# Altium schematic sheet RK3399_PMIU.SchDoc
size A4; SheetNumber: 11; SheetTotal: 20
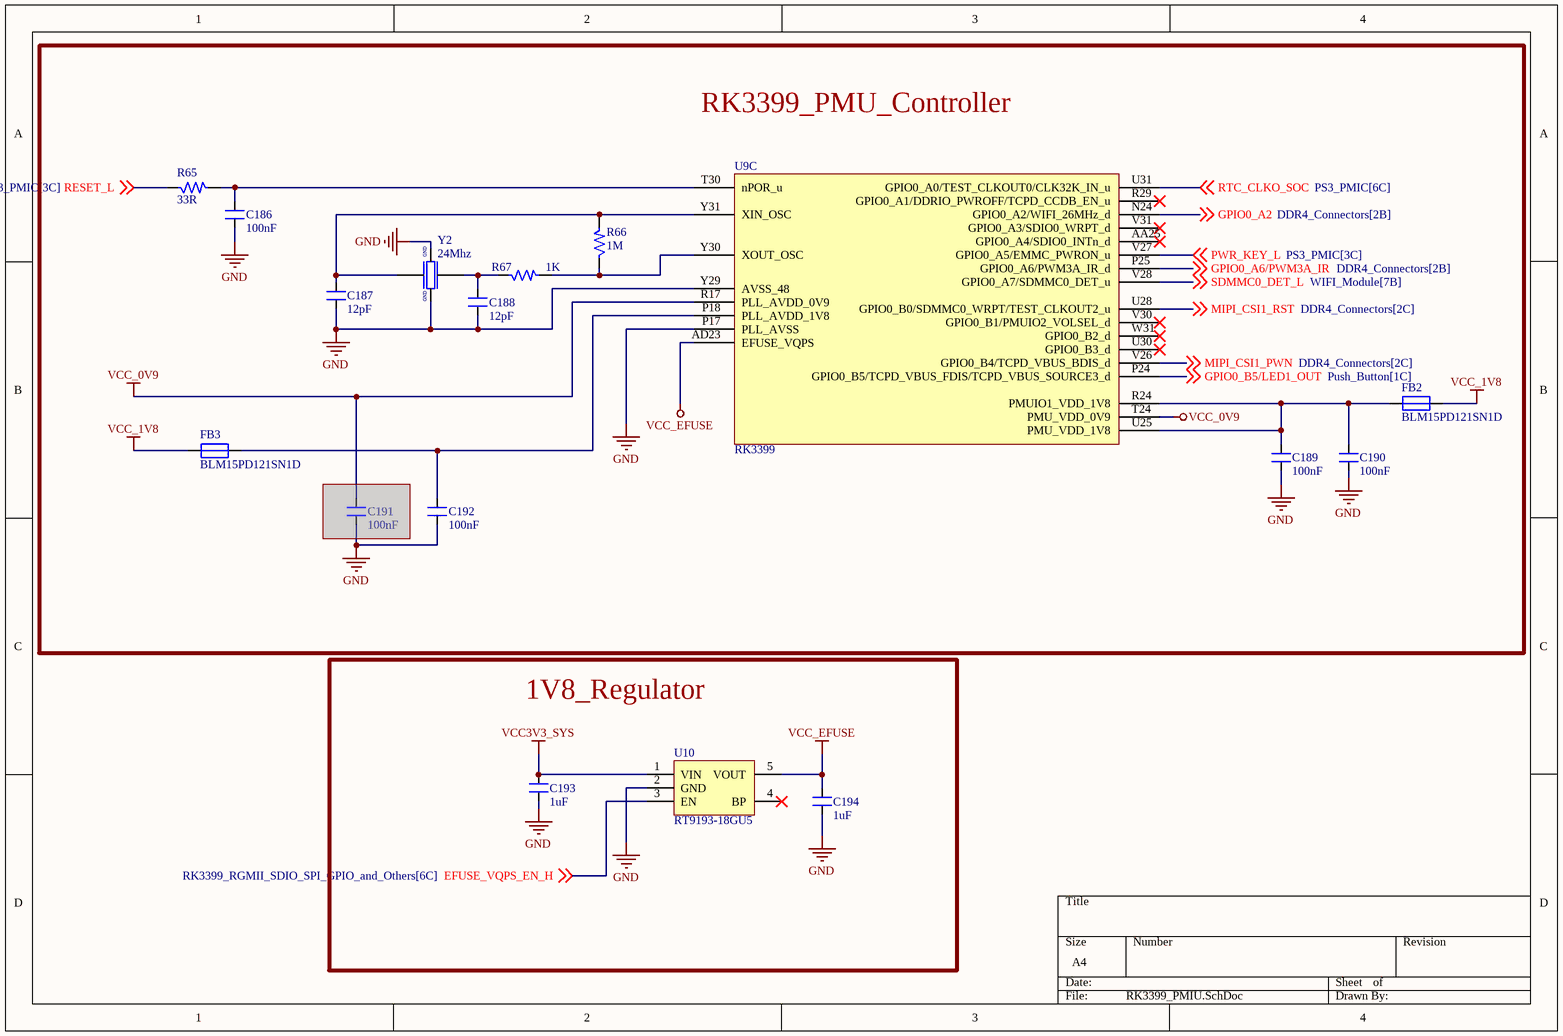
[diagram p0: RK3399_PMIU.SchDoc]

## Parts
C186  100nF  [CAP_0201]
C187  12pF  [CAP_0201]
C188  12pF  [CAP_0201]
C189  100nF  [CAP_0201]
C190  100nF  [CAP_0201]
C191  100nF  [CAP_0201]  (masked out: inside a compile mask, not in the netlist)
C192  100nF  [CAP_0201]
C193  1uF  [CAP_0201]
C194  1uF  [CAP_0201]
FB2  BLM15PD121SN1D  [RES_0402]
FB3  BLM15PD121SN1D  [RES_0402]
R65  33R  [RES_0201]
R66  1M  [RES_0201]
R67  1K  [RES_0201]
U9  RK3399  [FBGA828_23_826X826]  (part C of 24)
U10  RT9193-18GU5  [SC70-5]
Y2  24Mhz  [XTAL_ABM8AIG-24.000MHZ-12-2Z-T3]

## Blocks framed on the sheet
RK3399_PMU_Controller: C186-C192 FB2 FB3 R65-R67 U9 Y2
1V8_Regulator: C193 C194 U10

## Nets
GND: C186.1 C187.1 C188.1 C189.1 C190.1 C192.1 C193.1 C194.1 U9.P17(PLL_AVSS) U9.Y29(AVSS_48) U10.2(GND) Y2.2 Y2.4
VCC3V3_SYS: C193.2 U10.1(VIN)
VCC_0V9: U9.R17(PLL_AVDD_0V9) U9.T24(PMU_VDD_0V9)
VCC_1V8: FB2.2 FB3.1
VCC_EFUSE: C194.2 U9.AD23(EFUSE_VQPS) U10.5(VOUT)
EFUSE_VQPS_EN_H: U10.3(EN) ; off-sheet EFUSE_VQPS_EN_H
GPIO0_A2: U9.N24(GPIO0_A2/WIFI_26MHz_d) ; off-sheet GPIO0_A2
GPIO0_A6/PWM3A_IR: U9.P25(GPIO0_A6/PWM3A_IR_d) ; off-sheet GPIO0_A6/PWM3A_IR
GPIO0_B5/LED1_OUT: U9.P24(GPIO0_B5/TCPD_VBUS_FDIS/TCPD_VBUS_SOURCE3_d) ; off-sheet GPIO0_B5/LED1_OUT
MIPI_CSI1_PWN: U9.V26(GPIO0_B4/TCPD_VBUS_BDIS_d) ; off-sheet MIPI_CSI1_PWN
MIPI_CSI1_RST: U9.U28(GPIO0_B0/SDMMC0_WRPT/TEST_CLKOUT2_u) ; off-sheet MIPI_CSI1_RST
PWR_KEY_L: U9.V27(GPIO0_A5/EMMC_PWRON_u) ; off-sheet PWR_KEY_L
RESET_L: R65.1 ; off-sheet RESET_L
RTC_CLKO_SOC: U9.U31(GPIO0_A0/TEST_CLKOUT0/CLK32K_IN_u) ; off-sheet RTC_CLKO_SOC
SDMMC0_DET_L: U9.V28(GPIO0_A7/SDMMC0_DET_u) ; off-sheet SDMMC0_DET_L
NetC186_2: C186.2 R65.2 U9.T30(nPOR_u)
NetC187_2: C187.2 R66.2 U9.Y31(XIN_OSC) Y2.1
NetC188_2: C188.2 R67.1 Y2.3
NetC189_2: C189.2 C190.2 FB2.1 U9.R24(PMUIO1_VDD_1V8) U9.U25(PMU_VDD_1V8)
NetC192_2: C192.2 FB3.2 U9.P18(PLL_AVDD_1V8)
NetR66_1: R66.1 R67.2 U9.Y30(XOUT_OSC)

Not connected (* = marked no-connect by the designer): U9 AA25(GPIO0_A4/SDIO0_INTn_d)* R29(GPIO0_A1/DDRIO_PWROFF/TCPD_CCDB_EN_u)* U30(GPIO0_B3_d)* V30(GPIO0_B1/PMUIO2_VOLSEL_d)* V31(GPIO0_A3/SDIO0_WRPT_d)* W31(GPIO0_B2_d)*; U10 4(BP)*

## Notes on the sheet
- (in symbol XTAL_24Mhz-12pF-4-SMD) GND

## Library data of the parts
C186 C189-C192 = CAP_100nF-25V-10%-0201: 0.1µF ±10% 25V Ceramic Capacitor X5R 0201 (0603 Metric); Manufacturer: TDK Corporation; Manufacturer Part Number: C0603X5R1E104K030BB; Case/Package: 0201; Supplier-1: Digikey
C187 C188 = CAP_12pF-16V-10%-0201: 12pF ±10% 16V Ceramic Capacitor C0G, NP0 0201 (0603 Metric); Manufacturer: AVX Corporation; Manufacturer Part Number: 0201YA120KAT2A; Case/Package: 0201; Supplier-1: Digikey
C193 C194 = CAP_1uF-16V-10%-0201: 1µF ±20% 16V Ceramic Capacitor X5R 0201 (0603 Metric); Manufacturer: Samsung Electro-Mechanics; Manufacturer Part Number: CL03A105MO3NRNH; Case/Package: 0201; Supplier-1: Digikey
FB2 FB3 = FB_120R-1.3A-100Mhz-0402: 120 Ohms @ 100MHz 1 Power Line Ferrite Bead 0402 (1005 Metric) 1.3A 90mOhm; Manufacturer: Murata Electronics; Mnaufacturer Part Number: BLM15PD121SN1D; Case/Package: 0402; Supplier-1: Digikey
R65 = RES_33R-0.05W-1%-0201: 33 Ohms ±1% 0.05W, 1/20W Chip Resistor 0201 (0603 Metric) Thick Film; Manufacturer: Yageo; Manufacturer Part Number: RC0201FR-0733RL; Case/Package: 0201; Supplier-1: Digikey
R66 = RES_1M-0.05W-1%-0201: 1 MOhms ±1% 0.05W, 1/20W Chip Resistor 0201 (0603 Metric) Thick Film; Manufacturer: Yageo; Manufacturer Part Number: RC0201FR-071ML; Case/Package: 0201; Supplier-1: Digikey
R67 = RES_1K-0.05W-1%-0201: 1 kOhms ±1% 0.05W, 1/20W Chip Resistor 0201 (0603 Metric) Thick Film; Manufacturer: Yageo; Manufacturer Part Number: RC0201FR-071KL; Case/Package: 0201; Supplier-1: Digikey
U9 = IC_RK3399-FCBGA828: RK3399 is a low power, high performance processor for computing, personal mobile.; Manufacturer: Rockchip; Manufacturer Part Number: RK3399; Case/Package: FCBGA828; Supplier-1: Rockchip
U10 = REG_1.8V-300mA-5.5V-SC70-5: Linear Voltage Regulator IC 1 Output 300mA SC-70-5; Manufacturer: Richtek USA Inc.; Manufacturer Part Number: RT9193-18GU5; Case/Package: SC70-5; Supplier-1: Digikey
Y2 = XTAL_24Mhz-12pF-4-SMD: 24MHz ±20ppm Crystal 12pF 50 Ohms 4-SMD, No Lead; Manufacturer: Abracon LLC; Manufacturer Part Number: ABM8AIG-24.000MHZ-12-2Z-T3; Case/Package: SMD; Supplier-1: Digikey